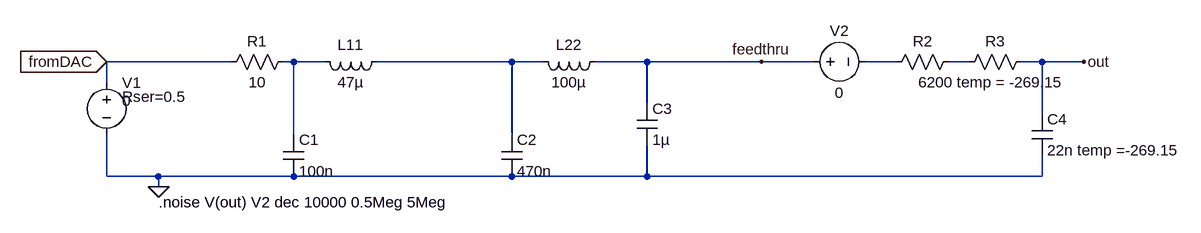
[diagram p0: schematic actualfilterfeedthru.asc]
actualfilterfeedthru.asc, the LTspice schematic file:
Version 4
SHEET 1 1476 680
WIRE 0 112 -192 112
WIRE 96 112 80 112
WIRE 144 112 96 112
WIRE 432 112 224 112
WIRE 480 112 432 112
WIRE 640 112 560 112
WIRE 816 112 640 112
WIRE 896 112 816 112
WIRE 1024 112 976 112
WIRE 1136 112 1104 112
WIRE 1248 112 1216 112
WIRE 1312 112 1248 112
WIRE -192 144 -192 112
WIRE 640 176 640 112
WIRE 1248 192 1248 112
WIRE 96 224 96 112
WIRE 432 224 432 112
WIRE -192 288 -192 224
WIRE -112 288 -192 288
WIRE 96 288 -112 288
WIRE 432 288 96 288
WIRE 640 288 640 240
WIRE 640 288 432 288
WIRE 1248 288 1248 256
WIRE 1248 288 640 288
WIRE -112 304 -112 288
FLAG -112 304 0
FLAG -192 112 fromDAC
IOPIN -192 112 In
FLAG 816 112 feedthru
FLAG 1312 112 out
SYMBOL cap 416 224 R0
SYMATTR InstName C2
SYMATTR Value 470n
SYMBOL cap 80 224 R0
SYMATTR InstName C1
SYMATTR Value 100n
SYMBOL voltage -192 128 R0
WINDOW 3 24 44 Left 2
WINDOW 123 24 44 Left 2
WINDOW 39 24 38 Left 2
SYMATTR Value 0
SYMATTR SpiceLine Rser=0.5
SYMATTR InstName V1
SYMBOL res 96 96 R90
WINDOW 0 0 56 VBottom 2
WINDOW 3 32 56 VTop 2
SYMATTR InstName R1
SYMATTR Value 10
SYMBOL ind 240 96 R90
WINDOW 0 5 56 VBottom 2
WINDOW 3 32 56 VTop 2
SYMATTR InstName L11
SYMATTR Value 47µ
SYMATTR SpiceLine Rser=3
SYMBOL ind 576 96 R90
WINDOW 0 5 56 VBottom 2
WINDOW 3 32 56 VTop 2
SYMATTR InstName L22
SYMATTR Value 100µ
SYMATTR SpiceLine Rser=3.7
SYMBOL cap 624 176 R0
SYMATTR InstName C3
SYMATTR Value 1µ
SYMBOL voltage 880 112 R270
WINDOW 0 32 56 VTop 2
WINDOW 3 -32 56 VBottom 2
SYMATTR InstName V2
SYMATTR Value 0
SYMBOL res 1120 96 R90
WINDOW 0 0 56 VBottom 2
WINDOW 3 32 56 VTop 2
SYMATTR InstName R2
SYMATTR Value 6
SYMBOL res 1232 96 R90
WINDOW 0 0 56 VBottom 2
WINDOW 3 32 56 VTop 2
SYMATTR InstName R3
SYMATTR Value 200 temp = -269.15
SYMBOL cap 1232 192 R0
SYMATTR InstName C4
SYMATTR Value 22n temp =-269.15
TEXT -112 328 Left 2 !.noise V(out) V2 dec 10000 0.5Meg 5Meg

The netlist it stands for:
* actualfilterfeedthru.asc
C2 N002 0 470n
C1 N001 0 100n
V1 fromDAC 0 0 Rser=0.5
R1 N001 fromDAC 10
L11 N002 N001 47µ Rser=3
L22 feedthru N002 100µ Rser=3.7
C3 feedthru 0 1µ
V2 feedthru N003 0
R2 N004 N003 6
R3 out N004 200 temp = -269.15
C4 out 0 22n temp =-269.15
.noise V(out) V2 dec 10000 0.5Meg 5Meg
.backanno
.end